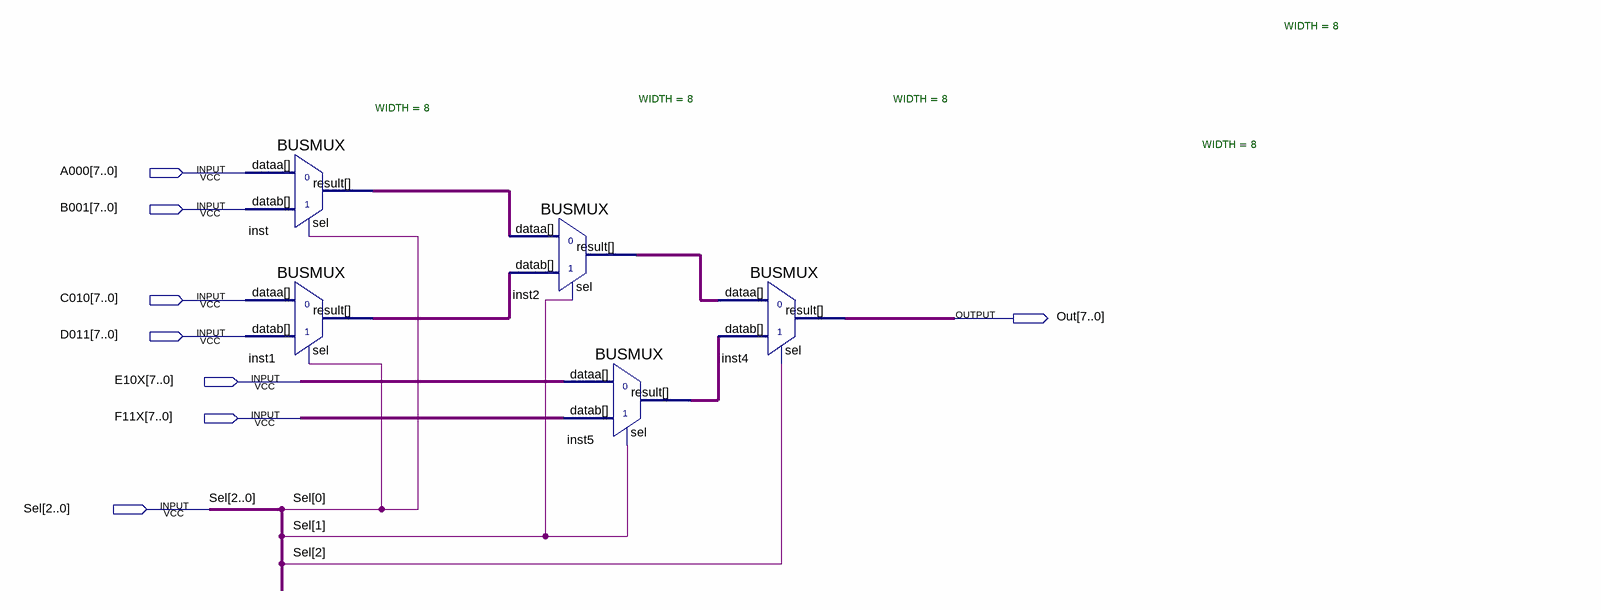
[diagram p0: schematic sheet]
// Quartus schematic Mux_6to1_8bit.bdf as structural Verilog: 5 symbols, 8 pins
module Mux_6to1_8bit (
  input  [7:0] A000,
  input  [7:0] B001,
  input  [7:0] C010,
  input  [7:0] D011,
  input  [7:0] E10X,
  input  [7:0] F11X,
  input  [2:0] Sel,
  output [7:0] Out
);

  wire [7:0] inst1_result, inst2_result, inst5_result, inst_result;

  BUSMUX #(.WIDTH(8)) inst (.datab(B001), .sel(Sel[0]), .dataa(A000), .result(inst_result));
  BUSMUX #(.WIDTH(8)) inst1 (.datab(D011), .sel(Sel[0]), .dataa(C010), .result(inst1_result));
  BUSMUX #(.WIDTH(8)) inst2 (.datab(inst1_result), .sel(Sel[1]), .dataa(inst_result), .result(inst2_result));
  BUSMUX #(.WIDTH(8)) inst5 (.datab(F11X), .sel(Sel[1]), .dataa(E10X), .result(inst5_result));
  BUSMUX #(.WIDTH(8)) inst4 (.datab(inst5_result), .sel(Sel[2]), .dataa(inst2_result), .result(Out));
endmodule
